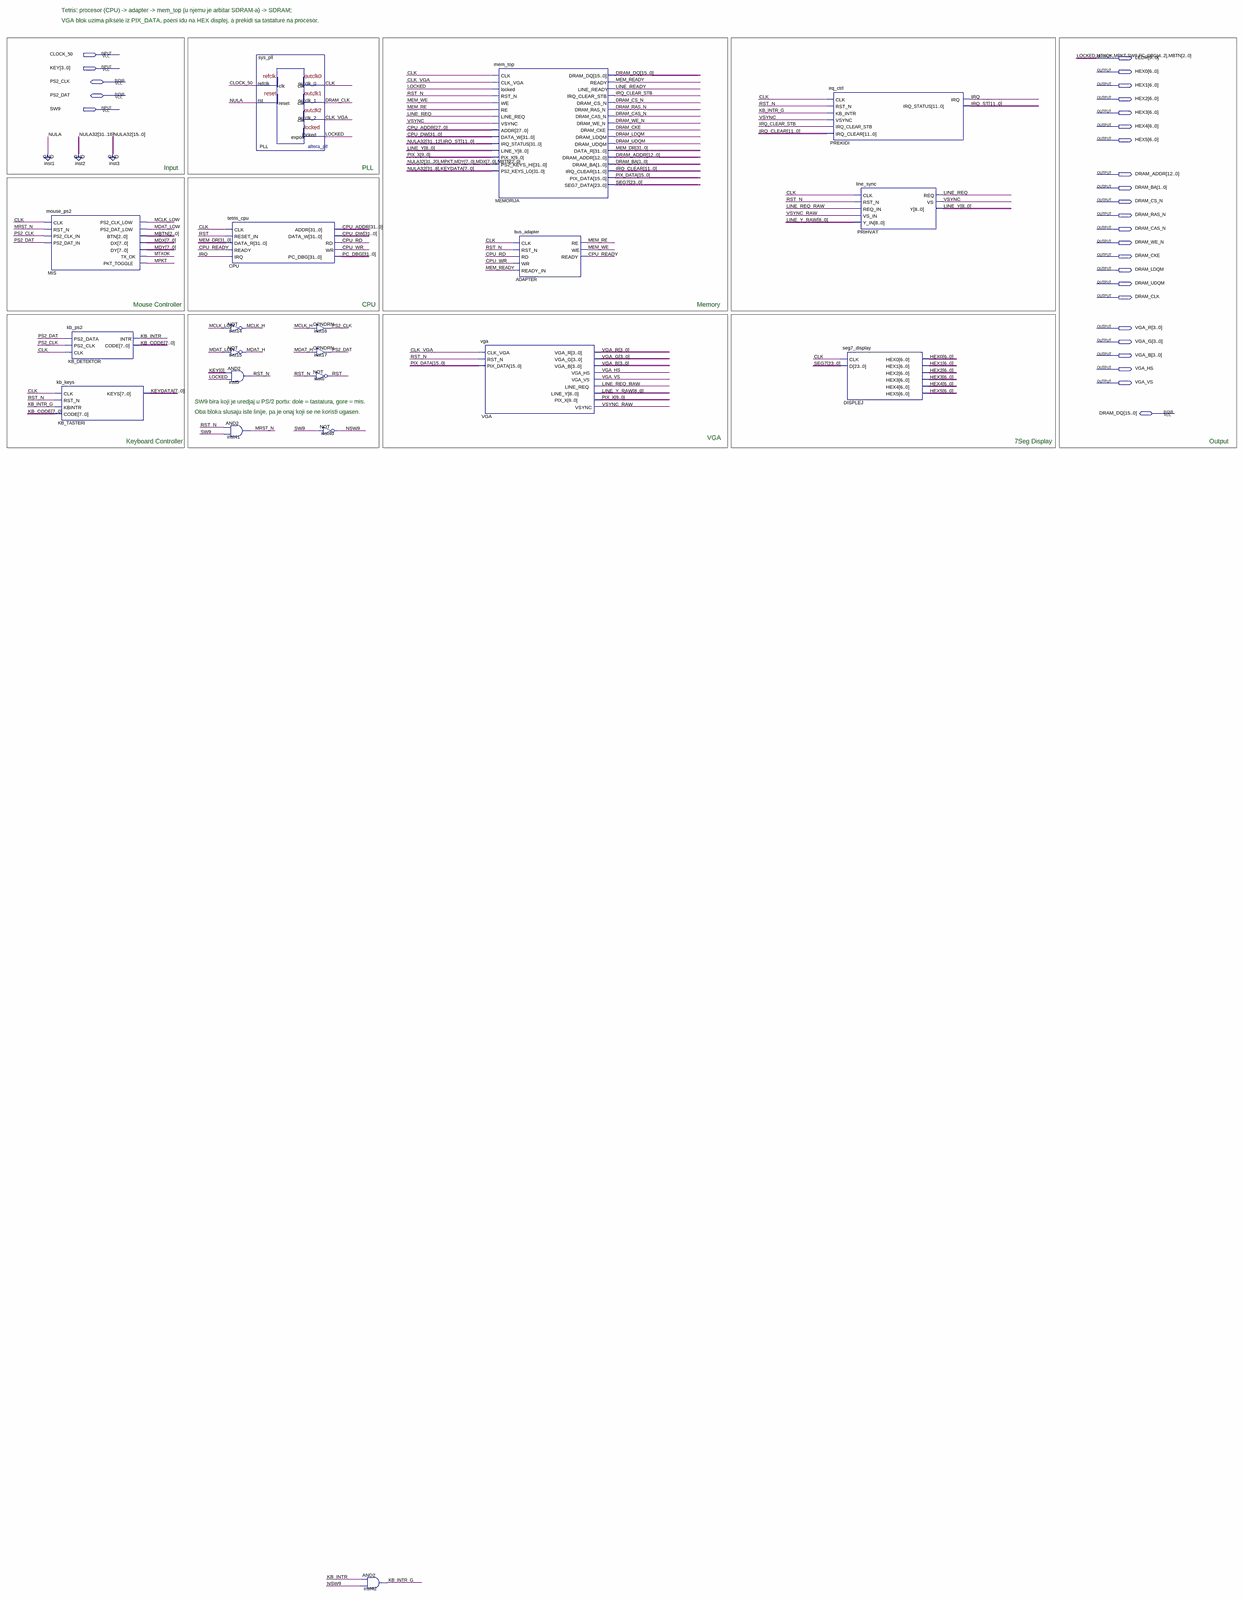
[diagram p0: schematic sheet, whole]
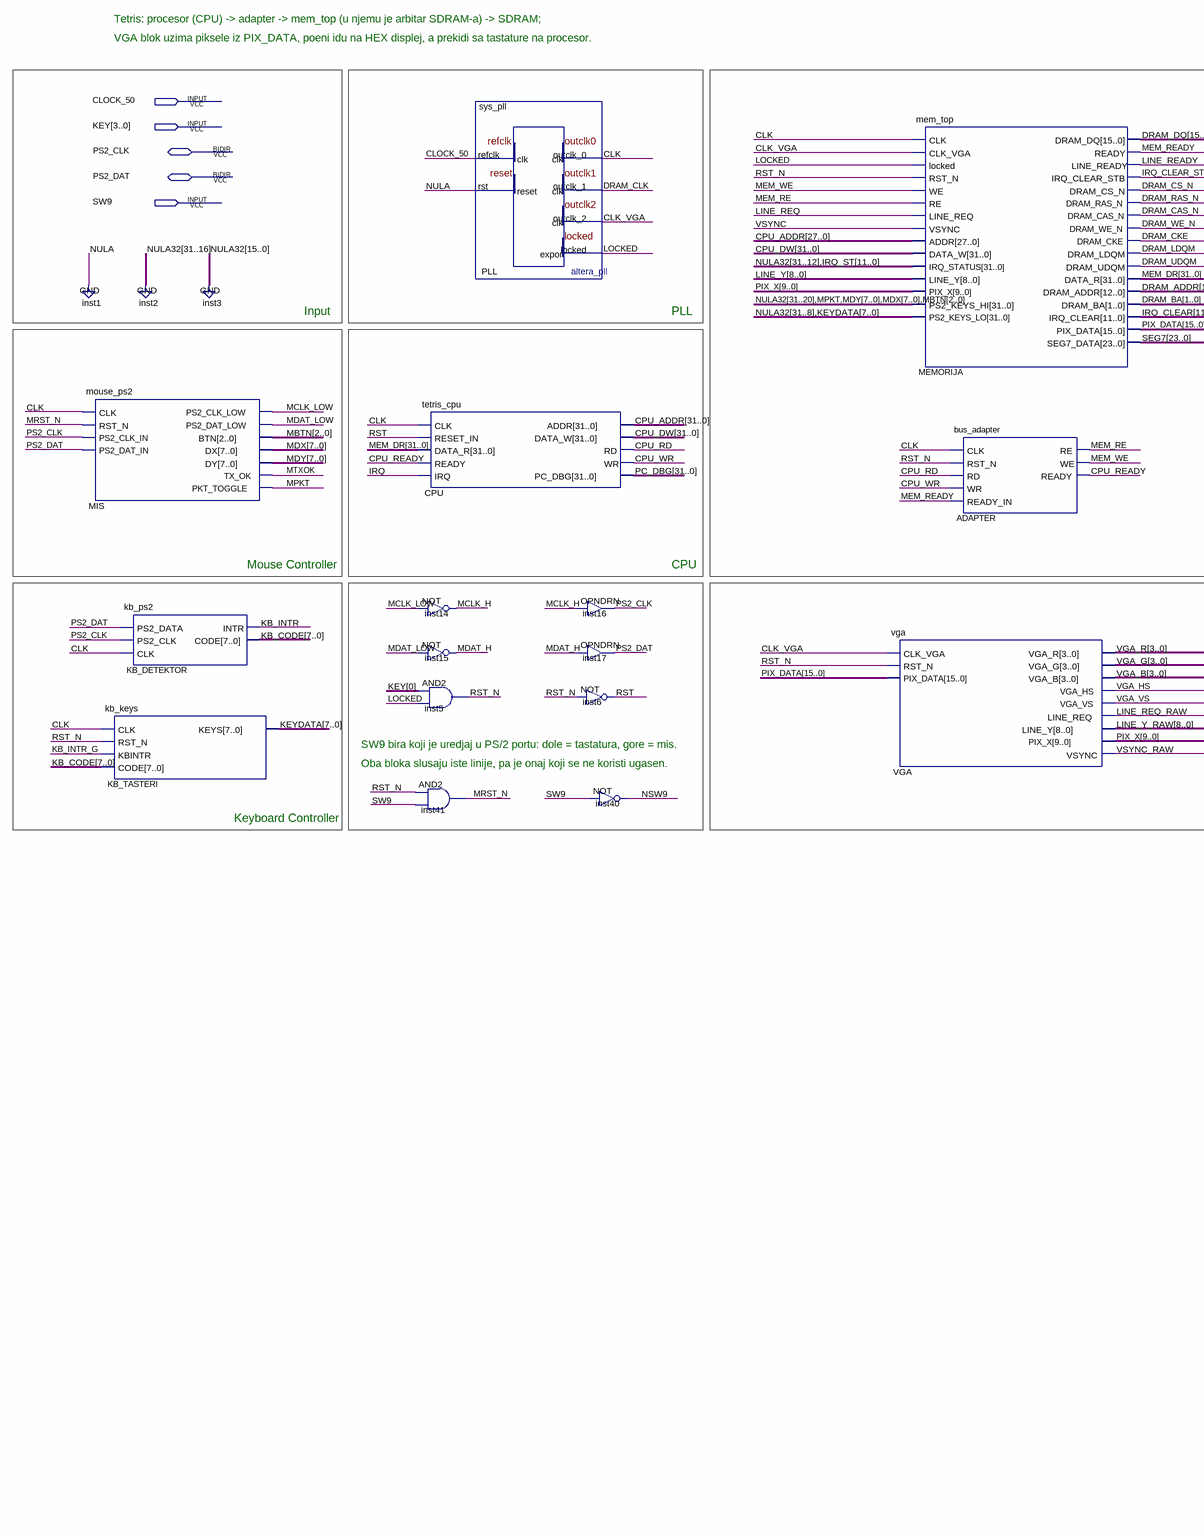
[diagram p1: schematic sheet, upper left part]
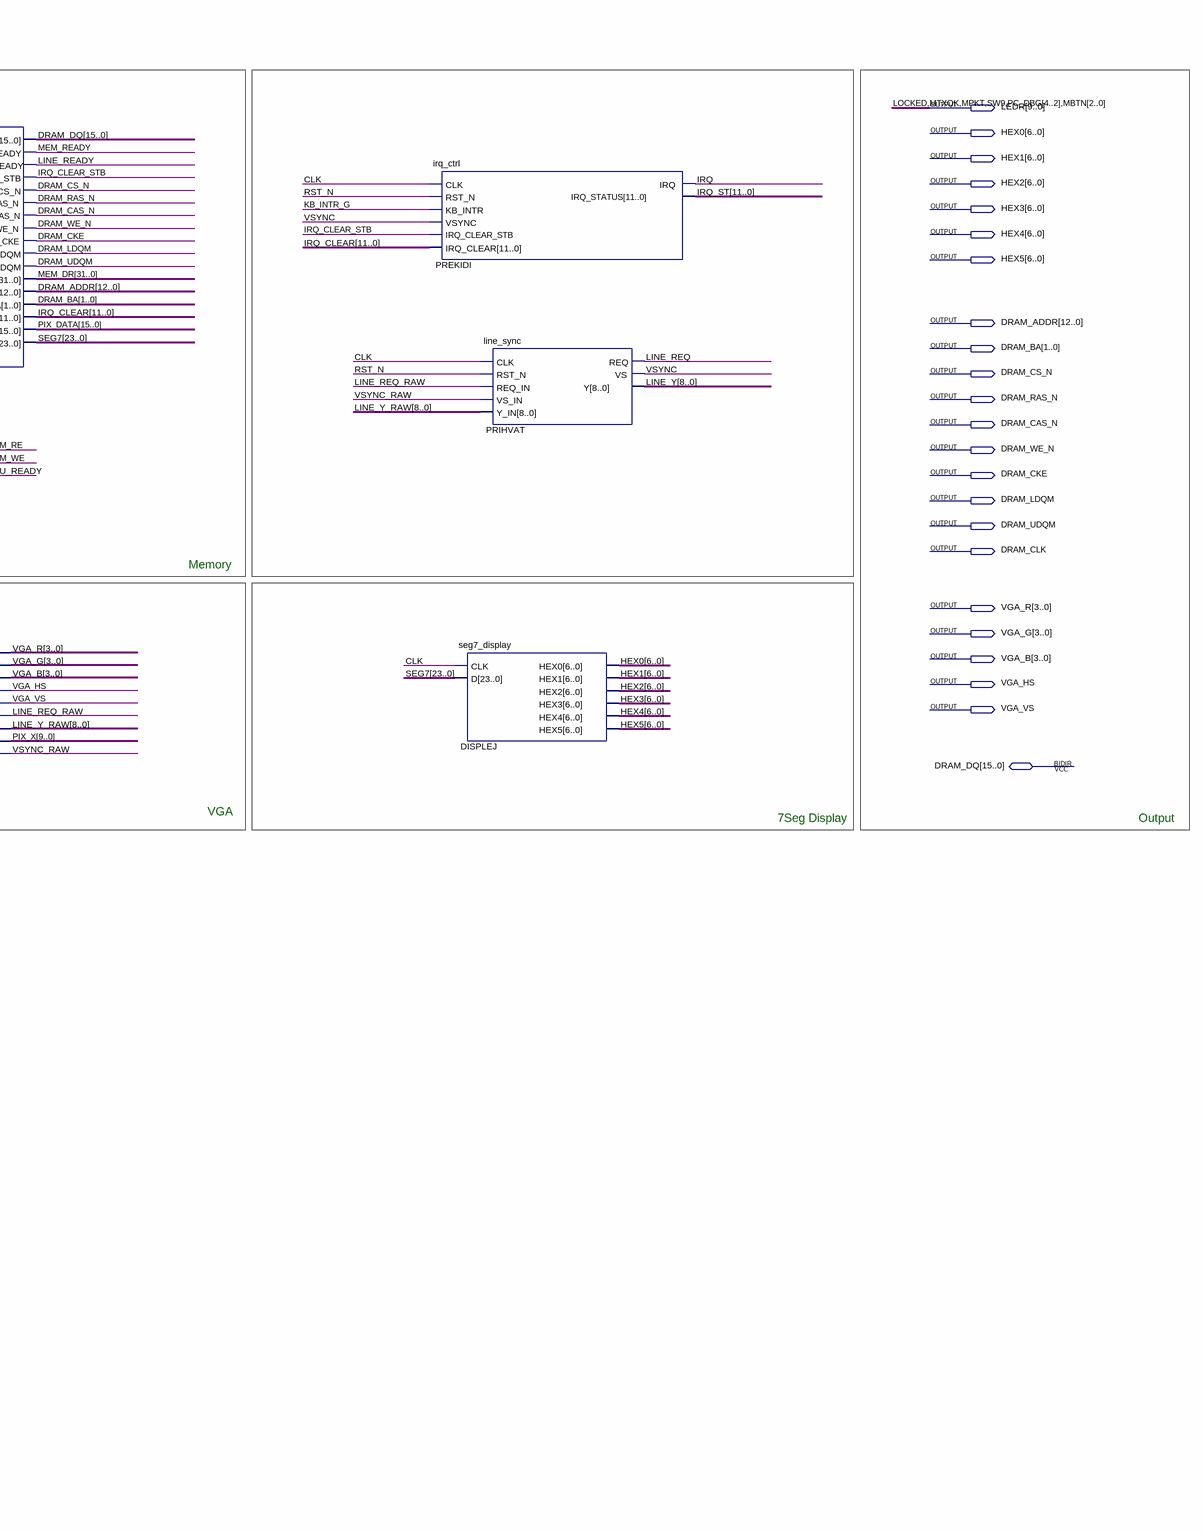
[diagram p2: schematic sheet, upper right part]
// Quartus schematic Tetris.bdf as structural Verilog: 20 symbols, 28 pins
module Tetris (
  input  CLOCK_50,
  input  [3:0] KEY,
  input  SW9,
  inout  PS2_CLK,
  inout  PS2_DAT,
  inout  [15:0] DRAM_DQ,
  output [9:0] LEDR,
  output [6:0] HEX0,
  output [6:0] HEX1,
  output [6:0] HEX2,
  output [6:0] HEX3,
  output [6:0] HEX4,
  output [6:0] HEX5,
  output [12:0] DRAM_ADDR,
  output [1:0] DRAM_BA,
  output DRAM_CS_N,
  output DRAM_RAS_N,
  output DRAM_CAS_N,
  output DRAM_WE_N,
  output DRAM_CKE,
  output DRAM_LDQM,
  output DRAM_UDQM,
  output DRAM_CLK,
  output [3:0] VGA_R,
  output [3:0] VGA_G,
  output [3:0] VGA_B,
  output VGA_HS,
  output VGA_VS
);

  wire CLK, CLK_VGA, CPU_RD, CPU_READY, CPU_WR, IRQ, IRQ_CLEAR_STB, KB_INTR, KB_INTR_G, LINE_READY, LINE_REQ,
       LINE_REQ_RAW, MCLK_H, MCLK_LOW, MDAT_H, MDAT_LOW, MEM_RE, MEM_READY, MEM_WE, MRST_N, NSW9, RST, RST_N,
       VSYNC, VSYNC_RAW;
  wire [7:0] KB_CODE, KEYDATA, MDX, MDY;
  wire [8:0] LINE_Y, LINE_Y_RAW;
  wire [9:0] PIX_X;
  wire [11:0] IRQ_CLEAR, IRQ_ST;
  wire [15:0] PIX_DATA;
  wire [23:0] SEG7;
  wire [31:0] CPU_ADDR, CPU_DW, MEM_DR, PC_DBG;

  mouse_ps2 MIS (
    .CLK(CLK), .RST_N(MRST_N), .PS2_CLK_IN(PS2_CLK), .PS2_DAT_IN(PS2_DAT), .PS2_CLK_LOW(MCLK_LOW),
    .PS2_DAT_LOW(MDAT_LOW), .BTN(LEDR[2:0]), .DX(MDX), .DY(MDY), .TX_OK(LEDR[8]), .PKT_TOGGLE(LEDR[7]));
  kb_keys KB_TASTERI (.CLK(CLK), .RST_N(RST_N), .KBINTR(KB_INTR_G), .CODE(KB_CODE), .KEYS(KEYDATA));
  kb_ps2 KB_DETEKTOR (.PS2_DATA(PS2_DAT), .PS2_CLK(PS2_CLK), .CLK(CLK), .INTR(KB_INTR), .CODE(KB_CODE));
  and inst41 (MRST_N, RST_N, SW9);
  tetris_cpu CPU (
    .CLK(CLK), .RESET_IN(RST), .DATA_R(MEM_DR), .READY(CPU_READY), .IRQ(IRQ), .ADDR(CPU_ADDR),
    .DATA_W(CPU_DW), .RD(CPU_RD), .WR(CPU_WR), .PC_DBG({PC_DBG[31:5], LEDR[5:3], PC_DBG[1:0]}));
  not inst14 (MCLK_H, MCLK_LOW);
  not inst15 (MDAT_H, MDAT_LOW);
  and inst5 (RST_N, KEY[0], LEDR[9]);
  sys_pll PLL (
    .refclk(CLOCK_50), .rst(1'b0), .outclk_0(CLK), .outclk_1(DRAM_CLK), .outclk_2(CLK_VGA), .locked(LEDR[9]));
  OPNDRN inst16 (.IN(MCLK_H), .OUT(PS2_CLK));
  OPNDRN inst17 (.IN(MDAT_H), .OUT(PS2_DAT));
  not inst6 (RST, RST_N);
  not inst40 (NSW9, SW9);
  and inst42 (KB_INTR_G, KB_INTR, NSW9);
  mem_top MEMORIJA (
    .CLK(CLK), .CLK_VGA(CLK_VGA), .locked(LEDR[9]), .RST_N(RST_N), .WE(MEM_WE), .RE(MEM_RE),
    .LINE_REQ(LINE_REQ), .VSYNC(VSYNC), .ADDR(CPU_ADDR[27:0]), .DATA_W(CPU_DW),
    .IRQ_STATUS({{20{1'b0}}, IRQ_ST}), .LINE_Y(LINE_Y), .PIX_X(PIX_X),
    .PS2_KEYS_HI({{12{1'b0}}, LEDR[7], MDY, MDX, LEDR[2:0]}), .PS2_KEYS_LO({{24{1'b0}}, KEYDATA}),
    .READY(MEM_READY), .LINE_READY(LINE_READY), .IRQ_CLEAR_STB(IRQ_CLEAR_STB), .DRAM_CS_N(DRAM_CS_N),
    .DRAM_RAS_N(DRAM_RAS_N), .DRAM_CAS_N(DRAM_CAS_N), .DRAM_WE_N(DRAM_WE_N), .DRAM_CKE(DRAM_CKE),
    .DRAM_LDQM(DRAM_LDQM), .DRAM_UDQM(DRAM_UDQM), .DATA_R(MEM_DR), .DRAM_ADDR(DRAM_ADDR), .DRAM_BA(DRAM_BA),
    .IRQ_CLEAR(IRQ_CLEAR), .PIX_DATA(PIX_DATA), .SEG7_DATA(SEG7), .DRAM_DQ(DRAM_DQ));
  vga VGA (
    .CLK_VGA(CLK_VGA), .RST_N(RST_N), .PIX_DATA(PIX_DATA), .VGA_R(VGA_R), .VGA_G(VGA_G), .VGA_B(VGA_B),
    .VGA_HS(VGA_HS), .VGA_VS(VGA_VS), .LINE_REQ(LINE_REQ_RAW), .LINE_Y(LINE_Y_RAW), .PIX_X(PIX_X),
    .VSYNC(VSYNC_RAW));
  bus_adapter ADAPTER (
    .CLK(CLK), .RST_N(RST_N), .RD(CPU_RD), .WR(CPU_WR), .READY_IN(MEM_READY), .RE(MEM_RE), .WE(MEM_WE),
    .READY(CPU_READY));
  irq_ctrl PREKIDI (
    .CLK(CLK), .RST_N(RST_N), .KB_INTR(KB_INTR_G), .VSYNC(VSYNC), .IRQ_CLEAR_STB(IRQ_CLEAR_STB),
    .IRQ_CLEAR(IRQ_CLEAR), .IRQ(IRQ), .IRQ_STATUS(IRQ_ST));
  seg7_display DISPLEJ (
    .CLK(CLK), .D(SEG7), .HEX0(HEX0), .HEX1(HEX1), .HEX2(HEX2), .HEX3(HEX3), .HEX4(HEX4), .HEX5(HEX5));
  line_sync PRIHVAT (
    .CLK(CLK), .RST_N(RST_N), .REQ_IN(LINE_REQ_RAW), .VS_IN(VSYNC_RAW), .Y_IN(LINE_Y_RAW), .REQ(LINE_REQ),
    .VS(VSYNC), .Y(LINE_Y));

  assign LEDR[6] = SW9;

  // Other names for the same wires on the sheet: LOCKED = LEDR[9]; MBTN[2:0] = LEDR[2:0]; MPKT = LEDR[7];
  //   MTXOK = LEDR[8]; PC_DBG[4:2] = LEDR[5:3]

  // Notes on the sheet:
  //   Tetris: procesor (CPU) -> adapter -> mem_top (u njemu je arbitar SDRAM-a) -> SDRAM;
  //   VGA blok uzima piksele iz PIX_DATA, poeni idu na HEX displej, a prekidi sa tastature na procesor.
  //   Input
  //   PLL
  //   Mouse Controller
  //   CPU
  //   Memory
  //   SW9 bira koji je uredjaj u PS/2 portu: dole = tastatura, gore = mis.
  //   Oba bloka slusaju iste linije, pa je onaj koji se ne koristi ugasen.
  //   VGA
  //   Keyboard Controller
  //   7Seg Display
  //   Output
endmodule
